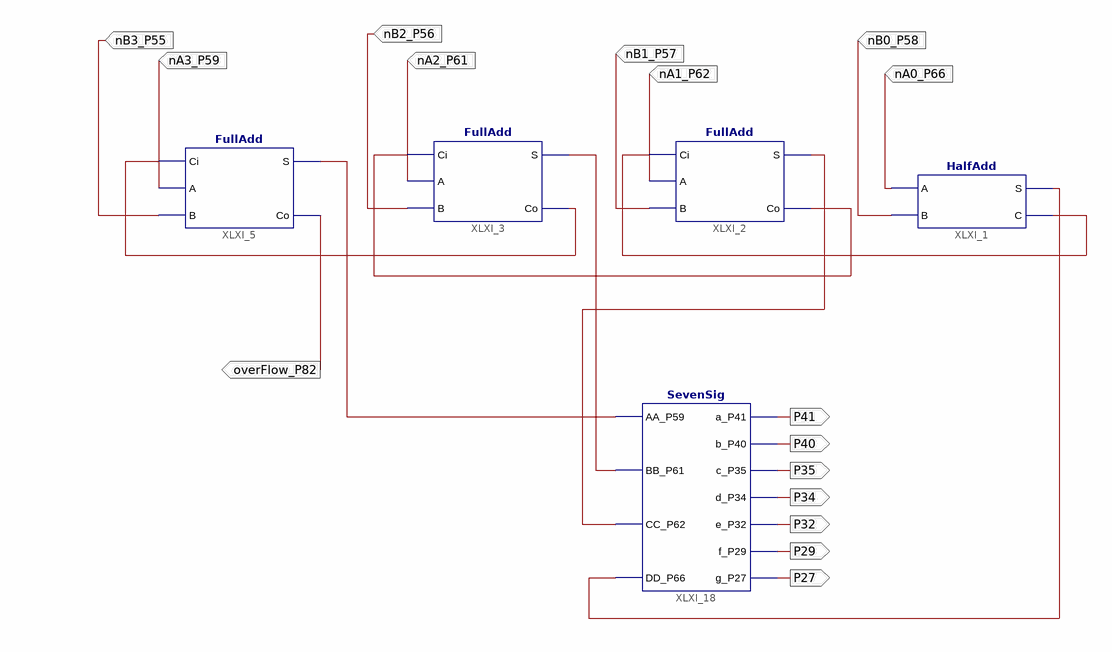
[diagram p0: schematic sheet 1]
// Xilinx ISE schematic Lab6_Add.sch (spartan6) as structural Verilog: 5 symbols, 16 ports
module Lab6_Add (
  input  nA0_P66,
  input  nB0_P58,
  input  nA1_P62,
  input  nA3_P59,
  input  nA2_P61,
  input  nB1_P57,
  input  nB2_P56,
  input  nB3_P55,
  output overFlow_P82,
  output P41,
  output P40,
  output P35,
  output P34,
  output P32,
  output P29,
  output P27
);

  wire s0_P78, s1_P75, s2_P74, s3_P67, XLXN_4, XLXN_7, XLXN_9;

  HalfAdd XLXI_1 (.A(nA0_P66), .B(nB0_P58), .S(s0_P78), .C(XLXN_4));
  FullAdd XLXI_2 (.Ci(XLXN_4), .A(nA1_P62), .B(nB1_P57), .S(s1_P75), .Co(XLXN_7));
  FullAdd XLXI_3 (.Ci(XLXN_7), .A(nA2_P61), .B(nB2_P56), .S(s2_P74), .Co(XLXN_9));
  FullAdd XLXI_5 (.Ci(XLXN_9), .A(nA3_P59), .B(nB3_P55), .S(s3_P67), .Co(overFlow_P82));
  SevenSig XLXI_18 (
    .AA_P59(s3_P67), .BB_P61(s2_P74), .CC_P62(s1_P75), .DD_P66(s0_P78), .a_P41(P41), .b_P40(P40),
    .c_P35(P35), .d_P34(P34), .e_P32(P32), .f_P29(P29), .g_P27(P27));
endmodule
